# Altium schematic sheet 接口.SchDoc: Template
size A4; CompanyName: BUPT; DrawnBy: BUPT_HCM; Organization: BUPT_Robot; Revision: A; SheetNumber: 1; SheetTotal: 1; Version: 0.0; LibVersion: 0.0
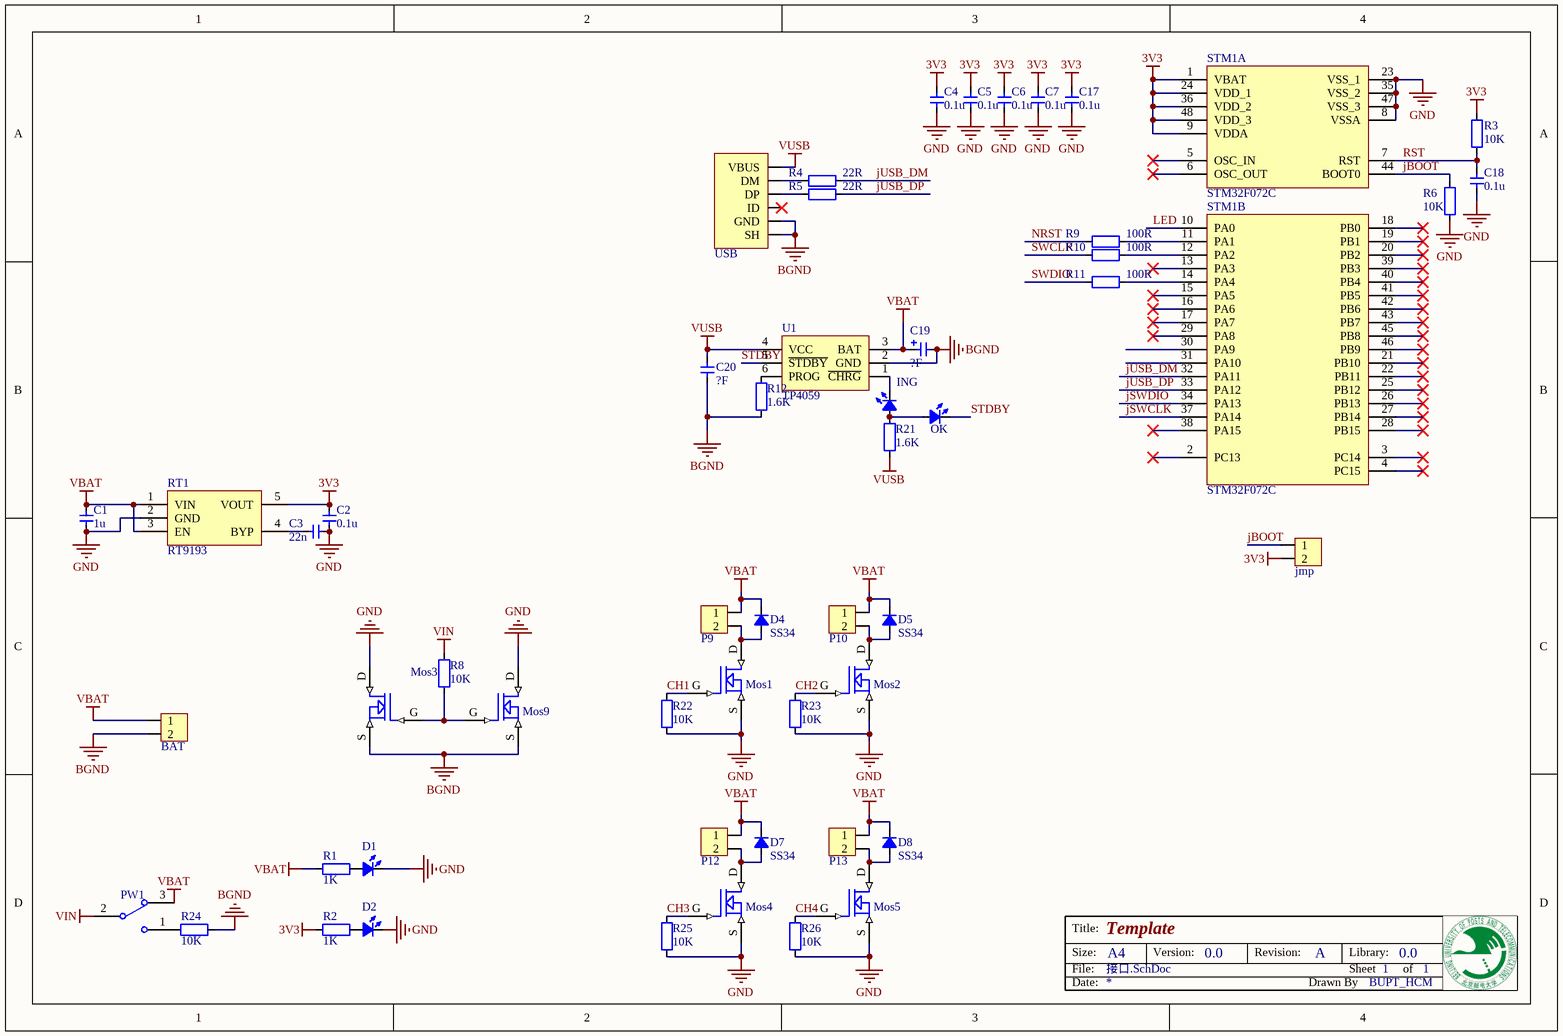
[diagram p0: 接口.SchDoc]

## Parts
BAT  HDR1x2_2.54  [HDR1X2_2.54_90]  (value not drawn)
C1  value 1u  [CAP_0603]  (hidden comment: Cap_0603)
C2  value 0.1u  [CAP_0603]  (hidden comment: Cap_0603)
C3  value 22n  [CAP_0603]  (hidden comment: Cap_0603)
C4  value 0.1u  [CAP_0603]  (hidden comment: Cap_0603)
C5  value 0.1u  [CAP_0603]  (hidden comment: Cap_0603)
C6  value 0.1u  [CAP_0603]  (hidden comment: Cap_0603)
C7  value 0.1u  [CAP_0603]  (hidden comment: Cap_0603)
C17  value 0.1u  [CAP_0603]  (hidden comment: Cap_0603)
C18  value 0.1u  [CAP_0603]  (hidden comment: Cap_0603)
C19  value ?F  [CAP_TAN_D2917]  (hidden comment: Cap_Tan_2917)
C20  value ?F  [CAP_0805]  (hidden comment: Cap_0805)
D1  LED_0805  [LED_0805_YELLOW]  (value not drawn)
D2  LED_0805  [LED_0805_YELLOW]  (value not drawn)
D4  value SS34  [DO-214AC]  (hidden comment: Diode_SMA)
D5  value SS34  [DO-214AC]  (hidden comment: Diode_SMA)
D7  value SS34  [DO-214AC]  (hidden comment: Diode_SMA)
D8  value SS34  [DO-214AC]  (hidden comment: Diode_SMA)
ING  LED_0805  [LED_0805_RED]  (value not drawn)
jmp  HDR1x2_2.54  [HDR1X2_2.54_180]  (value not drawn)
Mos1  MOSFET N  [Nmos_SOT23]  (value not drawn)
Mos2  MOSFET N  [Nmos_SOT23]  (value not drawn)
Mos3  MOSFET N  [Nmos_SOT23]  (value not drawn)
Mos4  MOSFET N  [Nmos_SOT23]  (value not drawn)
Mos5  MOSFET N  [Nmos_SOT23]  (value not drawn)
Mos9  MOSFET N  [Nmos_SOT23]  (value not drawn)
OK  LED_0805  [LED_0805_GREEN]  (value not drawn)
P9  HDR1x2_2.54  [HDR1X2_2.54_180]  (value not drawn)
P10  HDR1x2_2.54  [HDR1X2_2.54_180]  (value not drawn)
P12  HDR1x2_2.54  [HDR1X2_2.54_180]  (value not drawn)
P13  HDR1x2_2.54  [HDR1X2_2.54_180]  (value not drawn)
PW1  SwitchSPDT_2.8x6.6_90  [SwitchSPDT_2.8X6.6_90]  (value not drawn)
R1  value 1K  [RES_0603]  (hidden comment: Res_0603)
R2  value 1K  [RES_0603]  (hidden comment: Res_0603)
R3  value 10K  [RES_0603]  (hidden comment: Res_0603)
R4  value 22R  [RES_0603]  (hidden comment: Res_0603)
R5  value 22R  [RES_0603]  (hidden comment: Res_0603)
R6  value 10K  [RES_0603]  (hidden comment: Res_0603)
R8  value 10K  [RES_0603]  (hidden comment: Res_0603)
R9  value 100R  [RES_0603]  (hidden comment: Res_0603)
R10  value 100R  [RES_0603]  (hidden comment: Res_0603)
R11  value 100R  [RES_0603]  (hidden comment: Res_0603)
R12  value 1.6K  [RES_0603]  (hidden comment: Res_0603)
R21  value 1.6K  [RES_0603]  (hidden comment: Res_0603)
R22  value 10K  [RES_0603]  (hidden comment: Res_0603)
R23  value 10K  [RES_0603]  (hidden comment: Res_0603)
R24  value 10K  [RES_0603]  (hidden comment: Res_0603)
R25  value 10K  [RES_0603]  (hidden comment: Res_0603)
R26  value 10K  [RES_0603]  (hidden comment: Res_0603)
RT1  RT9193  [SOT23-5]
STM1  STM32F072C  [LQFP_P0.5_48]  (parts A,B of 2)
U1  TP4059  [SOT23-6]
USB  USB_Micro  [USB_Micro-AB]  (value not drawn)

## Nets
3V3: C2.2 C4.1 C5.1 C6.1 C7.1 C17.2 jmp.2 R2.1 R3.2 RT1.5(VOUT) STM1.1(VBAT) STM1.9(VDDA) STM1.24(VDD_1) STM1.36(VDD_2) STM1.48(VDD_3)
BGND: BAT.2 C19.2 C20.1 Mos3.S Mos9.S R12.2 R24.2 U1.2(GND) USB.0(SH) USB.5(GND)
GND: C1.1 C2.1 C3.1 C4.2 C5.2 C6.2 C7.2 C17.1 C18.1 D1.2(K) D2.2(K) Mos1.S Mos2.S Mos3.D Mos4.S Mos5.S Mos9.D R6.1 R22.1 R23.1 R25.1 R26.1 RT1.2(GND) STM1.8(VSSA) STM1.23(VSS_1) STM1.35(VSS_2) STM1.47(VSS_3)
VBAT: BAT.1 C1.2 C19.1 D4.2(K) D5.2(K) D7.2(K) D8.2(K) P9.1 P10.1 P12.1 P13.1 PW1.3 R1.1 RT1.1(VIN) RT1.3(EN) U1.3(BAT)
VIN: PW1.2 R8.2
VUSB: C20.2 R21.2 U1.4(VCC) USB.1(VBUS)
CH1: Mos1.G R22.2
CH2: Mos2.G R23.2
CH3: Mos4.G R25.2
CH4: Mos5.G R26.2
jBOOT: jmp.1 R6.2 STM1.44(BOOT0)
jSWCLK: STM1.37(PA14)
jSWDIO: STM1.34(PA13)
jUSB_DM: R4.2 STM1.32(PA11)
jUSB_DP: R5.2 STM1.33(PA12)
LED: STM1.10(PA0)
NRST: R9.1
RST: C18.2 R3.1 STM1.7(RST)
STDBY: OK.2(K) U1.5(~{STDBY})
SWCLK: R10.1
SWDIO: R11.1
NetC3_2: C3.2 RT1.4(BYP)
NetD1_1: D1.1(A) R1.2
NetD2_1: D2.1(A) R2.2
NetD4_1: D4.1(A) Mos1.D P9.2
NetD5_1: D5.1(A) Mos2.D P10.2
NetD7_1: D7.1(A) Mos4.D P12.2
NetD8_1: D8.1(A) Mos5.D P13.2
NetING_1: ING.1(A) OK.1(A) R21.1
NetING_2: ING.2(K) U1.1(~{CHRG})
NetMos3_G: Mos3.G Mos9.G R8.1
NetPW1_1: PW1.1 R24.1
NetR4_1: R4.1 USB.2(DM)
NetR5_1: R5.1 USB.3(DP)
NetR9_2: R9.2 STM1.11(PA1)
NetR10_2: R10.2 STM1.12(PA2)
NetR11_2: R11.2 STM1.14(PA4)
NetR12_1: R12.1 U1.6(PROG)

Not connected (* = marked no-connect by the designer): STM1 2(PC13)* 3(PC14)* 4(PC15)* 5(OSC_IN)* 6(OSC_OUT)* 13(PA3)* 15(PA5)* 16(PA6)* 17(PA7)* 18(PB0)* 19(PB1)* 20(PB2)* 21(PB10)* 22(PB11)* 25(PB12)* 26(PB13)* 27(PB14)* 28(PB15)* 29(PA8)* 30(PA9) 31(PA10) 38(PA15)* 39(PB3)* 40(PB4)* 41(PB5)* 42(PB6)* 43(PB7)* 45(PB8)* 46(PB9)*; USB 4(ID)*

## Notes on the sheet
- Title:
- Size:
- Date:
- File:
- A4
- Version:
- Revision:
- Drawn By
- Sheet
- Library:
- of

## Library data of the parts
BAT jmp = HDR1x2_2.54: Header
C1-C7 C17 C18 = Cap_0603: Capacitor
C19 = Cap_Tan_2917: Capacitor
C20 = Cap_0805: Capacitor
D1 D2 ING OK = LED_0805: LED
D4 D5 D7 D8 = Diode_SMA: Diode
Mos1-Mos5 Mos9 = MOSFET N: MOS SOT23
P9 P10 P12 P13 = HDR1x2_2.54T: Header
PW1 = SwitchSPDT_2.8x6.6_90: Switch
R1-R6 R8-R12 R21-R26 = Res_0603: Resistor
RT1 = RT9193: Power
STM1 = STM32F103C: MCU
USB = USB_Micro: USB